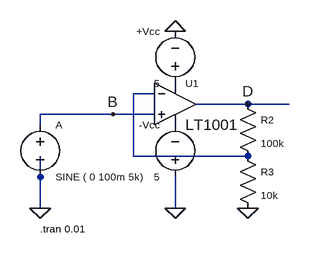
[diagram p0: schematic ερωτήματα 12-14.asc]
ερωτήματα 12-14.asc, the LTspice schematic file:
Version 4
SHEET 1 880 680
WIRE 112 144 80 144
WIRE 256 160 176 160
WIRE 320 160 256 160
WIRE 48 176 -64 176
WIRE 112 176 48 176
WIRE -64 192 -64 176
WIRE 80 240 80 144
WIRE 256 240 80 240
WIRE -64 272 -64 240
WIRE -64 320 -64 272
WIRE 144 320 144 272
FLAG 144 48 0
FLAG 256 320 0
FLAG -64 320 0
FLAG 144 320 0
FLAG 256 160 D
FLAG 48 176 B
SYMBOL voltage -64 176 R0
WINDOW 0 24 16 Left 1
WINDOW 3 24 96 Left 1
SYMATTR InstName A
SYMATTR Value SINE ( 0 100m 5k)
SYMBOL voltage 144 144 R180
WINDOW 0 24 96 Left 1
WINDOW 3 24 16 Left 1
SYMATTR InstName +Vcc
SYMATTR Value 5
SYMBOL voltage 144 288 R180
WINDOW 0 24 96 Left 1
WINDOW 3 24 16 Left 1
SYMATTR InstName -Vcc
SYMATTR Value 5
SYMBOL res 240 144 R0
WINDOW 0 36 40 Left 1
WINDOW 3 36 76 Left 1
SYMATTR InstName R2
SYMATTR Value 100k
SYMBOL res 240 224 R0
WINDOW 0 36 40 Left 1
WINDOW 3 36 76 Left 1
SYMATTR InstName R3
SYMATTR Value 10k
SYMBOL OpAmps\\LT1001 144 96 R0
WINDOW 0 16 32 Left 1
SYMATTR InstName U1
TEXT -64 352 Left 1 !.tran 0.01

The netlist it stands for:
* ερωτήματα 12-14.asc
V§A B 0 SINE ( 0 100m 5k)
V§+Vcc P001 0 5
V§-Vcc 0 P002 5
R2 D N001 100k
R3 N001 0 10k
XU1 B N001 P001 P002 D LT1001  ; pins In+ In- V+ V- OUT
.tran 0.01
.lib LTC.lib
.backanno
.end